# EAGLE design WBD_02 (EAGLE 9.6.2)
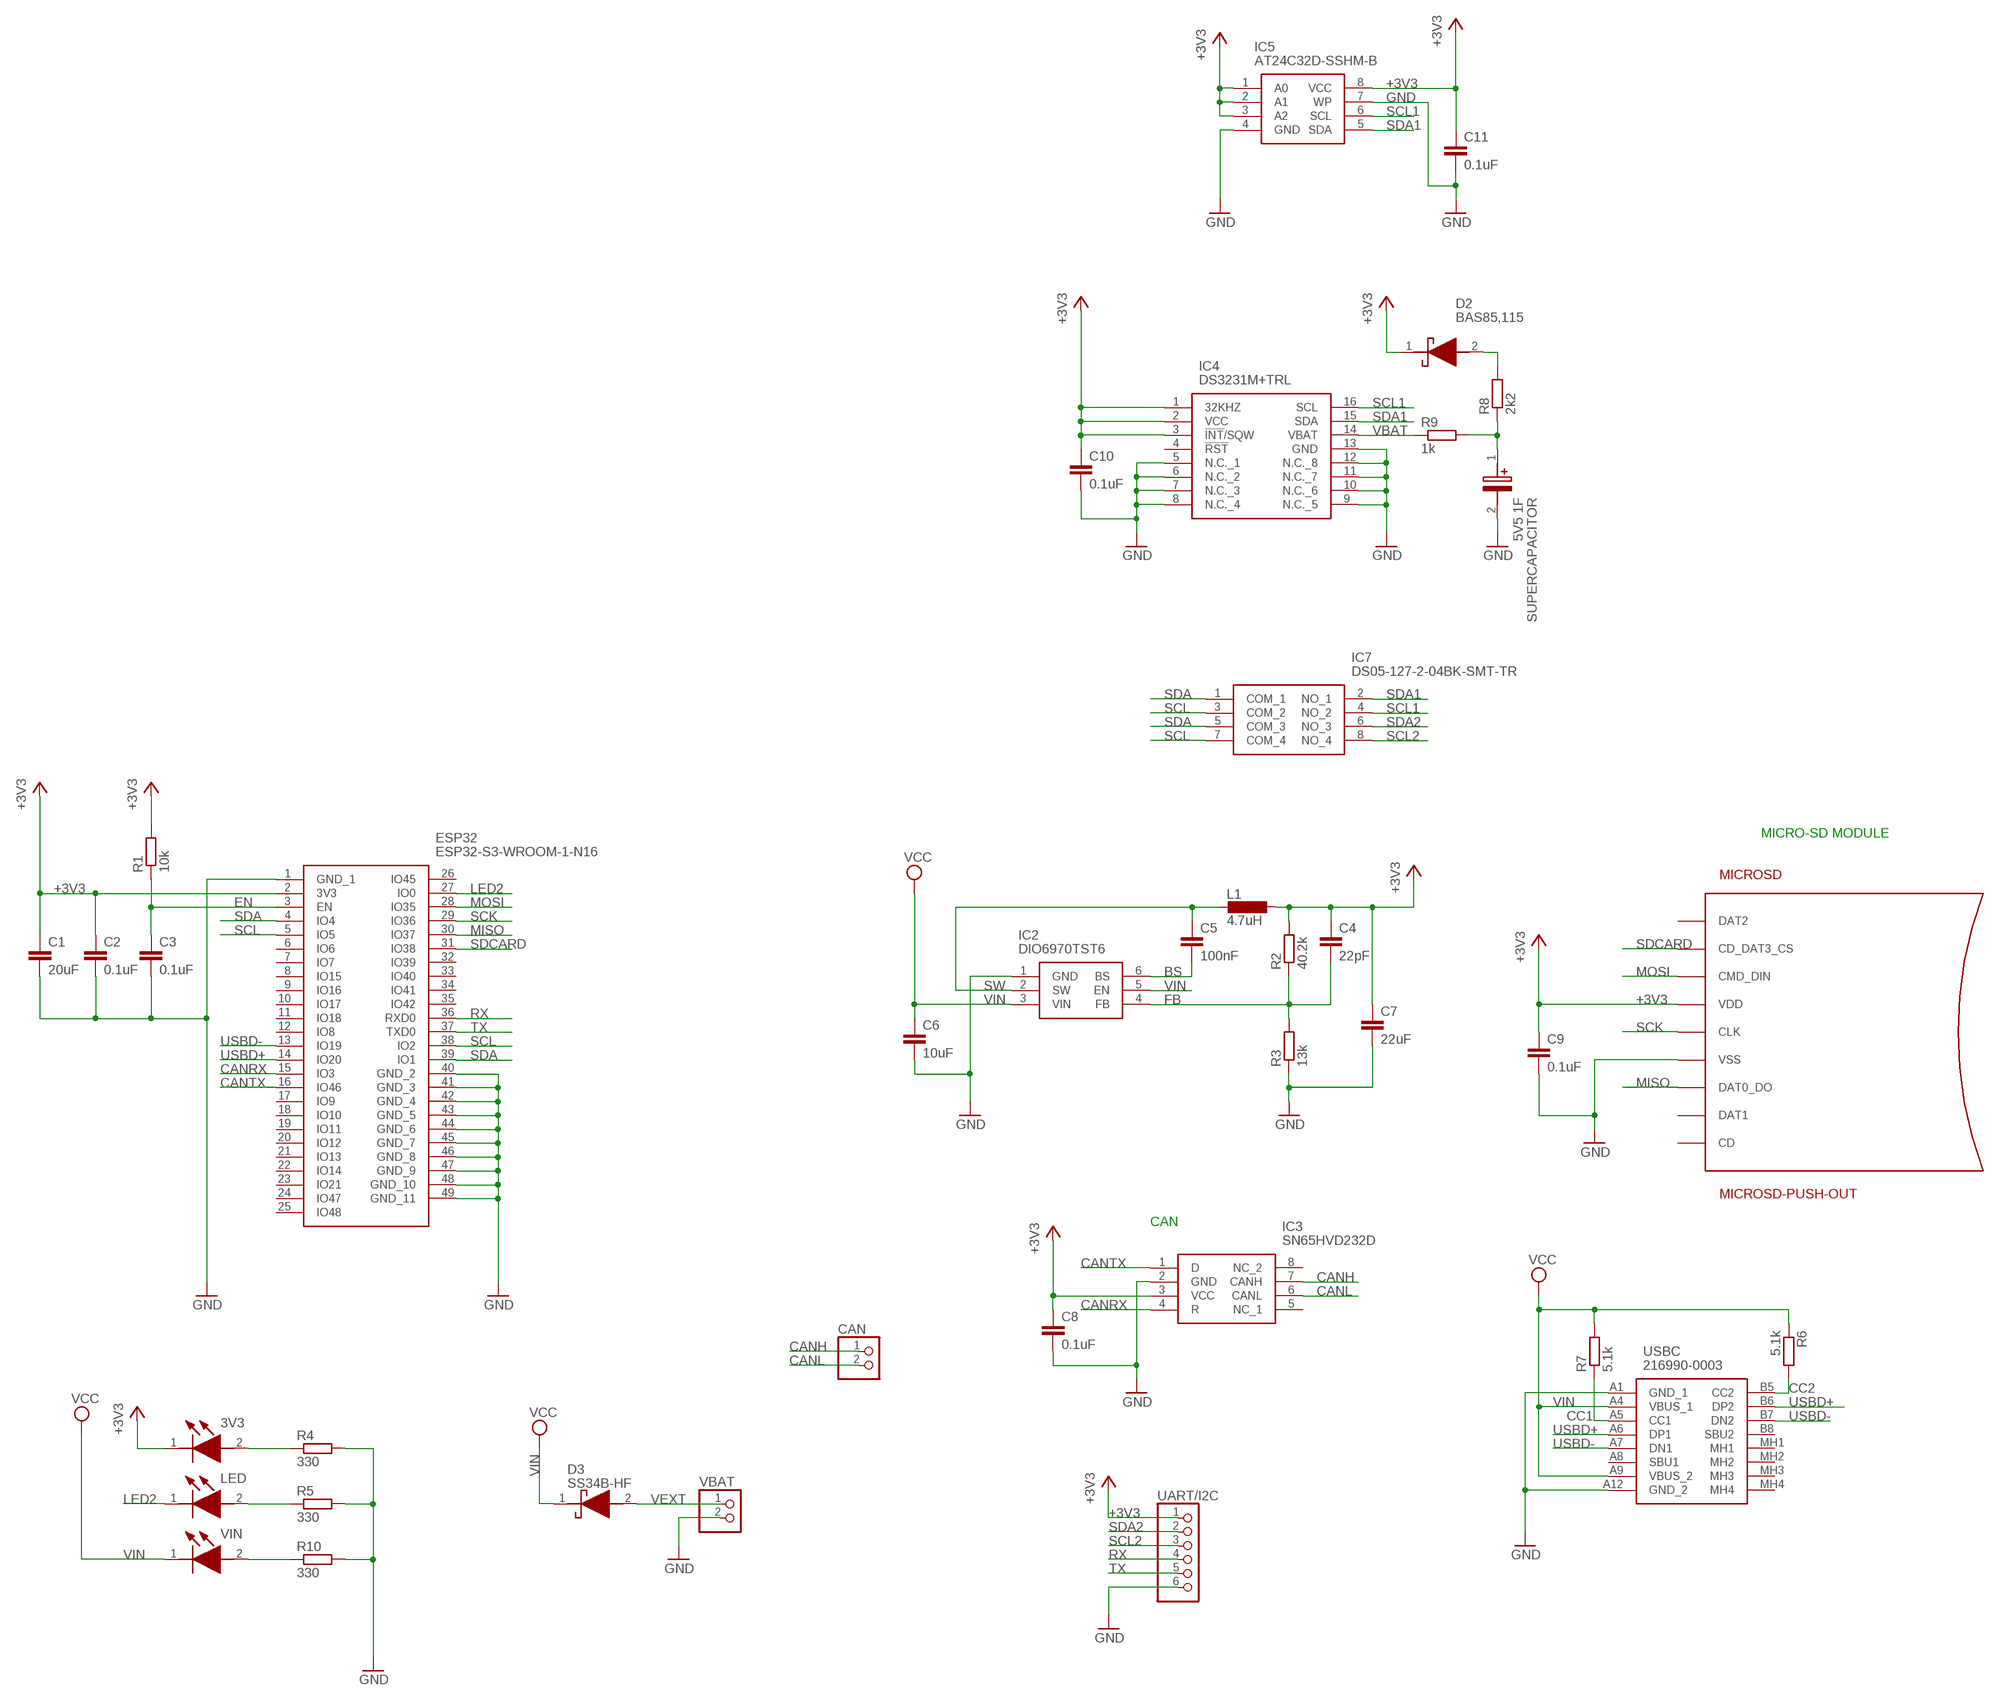
[diagram p0: schematic, sheet 1]

## Parts
3V3  150060GS75000  [LEDC1608X80N]
C1  20uF  C-EUC0603  [C0603]
C2  0.1uF  C-EUC0603  [C0603]
C3  0.1uF  C-EUC0603  [C0603]
C4  22pF  C-EUC0603  [C0603]
C5  100nF  C-EUC0603  [C0603]
C6  10uF  C-EUC0603  [C0603]
C7  22uF  C-EUC0603  [C0603]
C8  0.1uF  C-EUC0603  [C0603]
C9  0.1uF  C-EUC0603  [C0603]
C10  0.1uF  C-EUC0603  [C0603]
C11  0.1uF  C-EUC0603  [C0603]
CAN  PINHD-1X2  [1X02]
D2  BAS85,115  [BAS85115]
D3  SS34B-HF  [DIOM5336X320N]
ESP32  ESP32-S3-WROOM-1-N16  [ESP32S3WROOM1N16]
IC2  DIO6970TST6  [SOT95P280X90-6N]
IC3  SN65HVD232D  [SOIC127P600X175-8N]
IC4  DS3231M+TRL  [SOIC127P1032X265-16N]
IC5  AT24C32D-SSHM-B  [SOIC127P600X175-8N]
IC7  DS05-127-2-04BK-SMT-TR  [DS05127204BKSMTTR]
L1  4.7uH  L-EUL5650M  [L5650M]
LED  150060GS75000  [LEDC1608X80N]
MICROSD  MICROSD-PUSH-OUT  [MICROSD-PUSH-OUT]
R1  10k  R-EU_R0603  [R0603]
R2  40.2k  R-EU_R0603  [R0603]
R3  13k  R-EU_R0603  [R0603]
R4  330  R-EU_R0603  [R0603]
R5  330  R-EU_R0603  [R0603]
R6  5.1k  R-EU_R0603  [R0603]
R7  5.1k  R-EU_R0603  [R0603]
R8  2k2  R-EU_R0603  [R0603]
R9  1k  R-EU_R0603  [R0603]
R10  330  R-EU_R0603  [R0603]
SUPERCAPACITOR  5V5 1F  DB-5R5D105T  [CAPPRD500W130D2150H800]
UART/I2C  PINHD-1X6  [1X06]
USBC  216990-0003  [2169900003]
VBAT  PINHD-1X2  [1X02]
VIN  150060GS75000  [LEDC1608X80N]

## Nets
+3V3: 3V3.1(K) C1.1 C2.1 C4.1 C7.1 C8.1 C9.1 C10.1 C11.1 D2.1(K) ESP32.2(3V3) IC3.3(VCC) IC4.1(32KHZ) IC4.2(VCC) IC4.3(!INT!/SQW) IC5.1(A0) IC5.2(A1) IC5.3(A2) IC5.8(VCC) L1.1 MICROSD.4(VDD) R1.2 R2.2 UART/I2C.1
BS: C5.2 IC2.6(BS)
CANH: CAN.1 IC3.7(CANH)
CANL: CAN.2 IC3.6(CANL)
CANRX: ESP32.15(IO3) IC3.4(R)
CANTX: ESP32.16(IO46) IC3.1(D)
CC1: R7.1 USBC.A5(CC1)
CC2: R6.2 USBC.B5(CC2)
EN: C3.1 ESP32.3(EN) R1.1
FB: C4.2 IC2.4(FB) R2.1 R3.2
GND: C1.2 C2.2 C3.2 C6.2 C7.2 C8.2 C9.2 C10.2 C11.2 ESP32.1(GND_1) ESP32.40(GND_2) ESP32.41(GND_3) ESP32.42(GND_4) ESP32.43(GND_5) ESP32.44(GND_6) ESP32.45(GND_7) ESP32.46(GND_8) ESP32.47(GND_9) ESP32.48(GND_10) ESP32.49(GND_11) IC2.1(GND) IC3.2(GND) IC4.5(N.C._1) IC4.6(N.C._2) IC4.7(N.C._3) IC4.8(N.C._4) IC4.9(N.C._5) IC4.10(N.C._6) IC4.11(N.C._7) IC4.12(N.C._8) IC4.13(GND) IC5.4(GND) IC5.7(WP) MICROSD.6(VSS) MICROSD.G1(VSS) MICROSD.G2(VSS) MICROSD.G3(VSS) MICROSD.G4(VSS) R3.1 R4.2 R5.2 R10.2 SUPERCAPACITOR.2(-) UART/I2C.6 USBC.A1(GND_1) USBC.A12(GND_2) VBAT.2
LDR1: 3V3.2(A) R4.1
LDR2: LED.2(A) R5.1
LDR3: R10.1 VIN.2(A)
LED2: ESP32.27(IO0) LED.1(K)
MISO: ESP32.30(IO37) MICROSD.7(DAT0_DO)
MOSI: ESP32.28(IO35) MICROSD.3(CMD_DIN)
RTCBAT: R8.1 R9.2 SUPERCAPACITOR.1(+)
RTCD: D2.2(A) R8.2
RX: ESP32.36(RXD0) UART/I2C.4
SCK: ESP32.29(IO36) MICROSD.5(CLK)
SCL: ESP32.5(IO5) ESP32.38(IO2) IC7.3(COM_2) IC7.7(COM_4)
SCL1: IC4.16(SCL) IC5.6(SCL) IC7.4(NO_2)
SCL2: IC7.8(NO_4) UART/I2C.3
SDA: ESP32.4(IO4) ESP32.39(IO1) IC7.1(COM_1) IC7.5(COM_3)
SDA1: IC4.15(SDA) IC5.5(SDA) IC7.2(NO_1)
SDA2: IC7.6(NO_3) UART/I2C.2
SDCARD: ESP32.31(IO38) MICROSD.2(CD_DAT3_CS)
SW: C5.1 IC2.2(SW) L1.2
TX: ESP32.37(TXD0) UART/I2C.5
USBD+: ESP32.14(IO20) USBC.A6(DP1) USBC.B6(DP2)
USBD-: ESP32.13(IO19) USBC.A7(DN1) USBC.B7(DN2)
VBAT: IC4.14(VBAT) R9.1
VEXT: D3.2(A) VBAT.1
VIN: C6.1 D3.1(K) IC2.3(VIN) IC2.5(EN) R6.1 R7.2 USBC.A4(VBUS_1) USBC.A9(VBUS_2) VIN.1(K) ; supply symbol labelled VCC
Unconnected: ESP32.6(IO6) ESP32.7(IO7) ESP32.8(IO15) ESP32.9(IO16) ESP32.10(IO17) ESP32.11(IO18) ESP32.12(IO8) ESP32.17(IO9) ESP32.18(IO10) ESP32.19(IO11) ESP32.20(IO12) ESP32.21(IO13) ESP32.22(IO14) ESP32.23(IO21) ESP32.24(IO47) ESP32.25(IO48) ESP32.26(IO45) ESP32.32(IO39) ESP32.33(IO40) ESP32.34(IO41) ESP32.35(IO42) IC3.5(NC_1) IC3.8(NC_2) IC4.4(!RST) MICROSD.1(DAT2) MICROSD.8(DAT1) MICROSD.CD USBC.A8(SBU1) USBC.B8(SBU2) USBC.MH1 USBC.MH2 USBC.MH3 USBC.MH4

## Notes on the sheet
- MICRO-SD MODULE
- CAN

## Library data of the parts
3V3 LED VIN = SamacSys_Parts:150060GS75000: Wurth Elektronik WL-SMCW 520 nm Green LED, 1608 (0603) Clear SMD package Source: Datasheet <https://componentsearchengine.com/Datasheets/2/150060GS75000.pdf>; DESCRIPTION: Wurth Elektronik WL-SMCW 520 nm Green LED, 1608 (0603) Clear SMD package; HEIGHT: 0.8mm; MANUFACTURER_NAME: Wurth Elektronik; MANUFACTURER_PART_NUMBER: 150060GS75000; MOUSER_PART_NUMBER: 710-150060GS75000; MOUSER_PRICE-STOCK: https://www.mouser.co.uk/ProductDetail/Wurth-Elektronik/150060GS75000?qs=LlUlMxKIyB0UYkq5lDO8nA%3D%3D
C1-C11 = rcl:C-EU: CAPACITOR, European symbol
CAN VBAT = pinhead:PINHD-1X2: PIN HEADER
D2 = SamacSys_Parts:BAS85,115: Schottky Diodes & Rectifiers SCHOTTKY 30V 200MA Source: Datasheet <https://assets.nexperia.com/documents/data-sheet/BAS85.pdf>; DESCRIPTION: Schottky Diodes & Rectifiers SCHOTTKY 30V 200MA; HEIGHT: 1.6mm; MANUFACTURER_NAME: Nexperia; MANUFACTURER_PART_NUMBER: BAS85,115; MOUSER_PART_NUMBER: 771-BAS85-T/R; MOUSER_PRICE-STOCK: https://www.mouser.co.uk/ProductDetail/Nexperia/BAS85115?qs=me8TqzrmIYWCmVXtgUH2Gg%3D%3D
D3 = SamacSys_Parts:SS34B-HF: Schottky Diodes & Rectifiers DIODE SCHOTTKY 3A 40V SMB Source: Datasheet <https://www.mouser.jp/datasheet/2/80/SP-JB017_SS34B-HF_Thru._SS320B-HF_RevB-1847021.pdf>; DESCRIPTION: Schottky Diodes & Rectifiers DIODE SCHOTTKY 3A 40V SMB; HEIGHT: 3.2mm; MANUFACTURER_NAME: Comchip Technology; MANUFACTURER_PART_NUMBER: SS34B-HF; MOUSER_PART_NUMBER: 750-SS34B-HF; MOUSER_PRICE-STOCK: https://www.mouser.co.uk/ProductDetail/Comchip-Technology/SS34B-HF?qs=vmHwEFxEFR9G1M%252BcUPG%2FxQ%3D%3D
ESP32 = ESP32-S3-WROOM-1-N16:ESP32-S3-WROOM-1-N16: WiFi Modules - 802.11 [Engineering Samples] SMD Module, ESP32-S3, 16 MB SPI Flash, PCB Antenna Source: Datasheet <https://www.espressif.com/sites/default/files/documentation/esp32-s3-wroom-1_wroom-1u_datasheet_en.pdf>; DESCRIPTION: WiFi Modules - 802.11 [Engineering Samples] SMD Module, ESP32-S3, 16 MB SPI Flash, PCB Antenna; HEIGHT: 3.25mm; MANUFACTURER_NAME: Espressif Systems; MANUFACTURER_PART_NUMBER: ESP32-S3-WROOM-1-N16; MOUSER_PART_NUMBER: 356-ESP32S3WROOM1N16; MOUSER_PRICE-STOCK: https://www.mouser.co.uk/ProductDetail/Espressif-Systems/ESP32-S3-WROOM-1-N16?qs=Li%252BoUPsLEntjPrtJwwS5Pw%3D%3D
IC2 = SamacSys_Parts:DIO6970TST6: Switching Voltage Regulators 2A Step Converter 24V Input Sync Source: Datasheet; DESCRIPTION: Switching Voltage Regulators 2A Step Converter 24V Input Sync; HEIGHT: 0.9mm; MANUFACTURER_NAME: DIOO Microcircuits; MANUFACTURER_PART_NUMBER: DIO6970TST6; MOUSER_PART_NUMBER: 453-DIO6970ST6; MOUSER_PRICE-STOCK: https://www.mouser.co.uk/ProductDetail/DIOO-Microcircuits/DIO6970TST6?qs=%252BEew9%252B0nqrCWpKu8WqElxA%3D%3D
IC3 = SamacSys_Parts:SN65HVD232D: CAN Transceiver 1Mbit/s ISO 11898, 8-Pin SOIC Source: Datasheet <http://www.ti.com/lit/ds/symlink/sn65hvd232.pdf>; DESCRIPTION: CAN Transceiver 1Mbit/s ISO 11898, 8-Pin SOIC; HEIGHT: 1.75mm; MANUFACTURER_NAME: Texas Instruments; MANUFACTURER_PART_NUMBER: SN65HVD232D; MOUSER_PART_NUMBER: 595-SN65HVD232D; MOUSER_PRICE-STOCK: https://www.mouser.co.uk/ProductDetail/Texas-Instruments/SN65HVD232D?qs=QViXGNcIEAueLIS9b8IyYg%3D%3D
IC4 = SamacSys_Parts:DS3231M+TRL: +/-5ppm, I2C Real-Time Clock Source: Datasheet <http://componentsearchengine.com/Datasheets/1/DS3231M TRL.pdf>; DESCRIPTION: +/-5ppm, I2C Real-Time Clock; HEIGHT: 2.65mm; MANUFACTURER_NAME: Maxim Integrated; MANUFACTURER_PART_NUMBER: DS3231M+TRL; MOUSER_PART_NUMBER: 700-DS3231M+TRL; MOUSER_PRICE-STOCK: https://www.mouser.co.uk/ProductDetail/Maxim-Integrated/DS3231M%2bTRL?qs=Bakm8ERcljq5PBzSwLfmgg%3D%3D
IC5 = SamacSys_Parts:AT24C32D-SSHM-B: AT24C32D-SSHM-B, EEPROM Memory 32kbit,, 4096 x, 8bit, Serial-2 Wire, 550ns 1.7 5.5 V, 8-Pin SOIC Source: Datasheet <http://www.atmel.com/images/atmel-8866-seeprom-at24c32d-datasheet.pdf>; DESCRIPTION: AT24C32D-SSHM-B, EEPROM Memory 32kbit,, 4096 x, 8bit, Serial-2 Wire, 550ns 1.7 5.5 V, 8-Pin SOIC; HEIGHT: 1.75mm; MANUFACTURER_NAME: Microchip; MANUFACTURER_PART_NUMBER: AT24C32D-SSHM-B; MOUSER_PART_NUMBER: 556-AT24C32D-SSHM-B; MOUSER_PRICE-STOCK: https://www.mouser.co.uk/ProductDetail/Microchip-Technology-Atmel/AT24C32D-SSHM-B?qs=ZZMt4ii29sN2mTRLl%2FnVJA%3D%3D
IC7 = SamacSys_Parts:DS05-127-2-04BK-SMT-TR: DIP Switches / SIP Switches DIP Switch, SPST, 1.27 pitch, flat actuator, SMT, Tape and reel, 4 position, Black Source: Datasheet <https://www.cuidevices.com/product/resource/digikeypdf/ds05-127-smt.pdf>; DESCRIPTION: DIP Switches / SIP Switches DIP Switch, SPST, 1.27 pitch, flat actuator, SMT, Tape and reel, 4 position, Black; HEIGHT: 2.6mm; MANUFACTURER_NAME: CUI Devices; MANUFACTURER_PART_NUMBER: DS05-127-2-04BK-SMT-TR; MOUSER_PART_NUMBER: 490-DS05127204BK-STR; MOUSER_PRICE-STOCK: https://www.mouser.co.uk/ProductDetail/CUI-Devices/DS05-127-2-04BK-SMT-TR?qs=wnTfsH77Xs6LBykqEPH3sg%3D%3D
L1 = rcl:L-EU: INDUCTOR, European symbol; SPICEPREFIX: L
MICROSD = microsd:MICROSD-PUSH-OUT: T-Flash Push-Out Micro SD Card Reader 14.75mm x 14.5mm SMD with external pins
R1-R10 = rcl:R-EU_: RESISTOR, European symbol; SPICEPREFIX: R
SUPERCAPACITOR = SamacSys_Parts:DB-5R5D105T: Supercapacitors / Ultracapacitors MEM CAP 5.5V 1.0F Source: Datasheet; DESCRIPTION: Supercapacitors / Ultracapacitors MEM CAP 5.5V 1.0F; HEIGHT: 8mm; MANUFACTURER_NAME: Elna; MANUFACTURER_PART_NUMBER: DB-5R5D105T; MOUSER_PART_NUMBER: 555-DB-5R5D105T; MOUSER_PRICE-STOCK: https://www.mouser.co.uk/ProductDetail/Elna/DB-5R5D105T?qs=r8OyiFxb6Rcu1BWmqcONIQ%3D%3D
UART/I2C = pinhead:PINHD-1X6: PIN HEADER
USBC = SamacSys_Parts:216990-0003: USB Connectors Mid-Mnt SMT CH0.58 16Ckt Type C Rec. Source: Datasheet <https://www.molex.com/pdm_docs/sd/2169900003_sd.pdf>; DESCRIPTION: USB Connectors Mid-Mnt SMT CH0.58 16Ckt Type C Rec.; HEIGHT: 3.36mm; MANUFACTURER_NAME: Molex; MANUFACTURER_PART_NUMBER: 216990-0003; MOUSER_PART_NUMBER: 538-216990-0003; MOUSER_PRICE-STOCK: https://www.mouser.co.uk/ProductDetail/Molex/216990-0003?qs=DRkmTr78QASn0GILUGAYCA%3D%3D

## Board
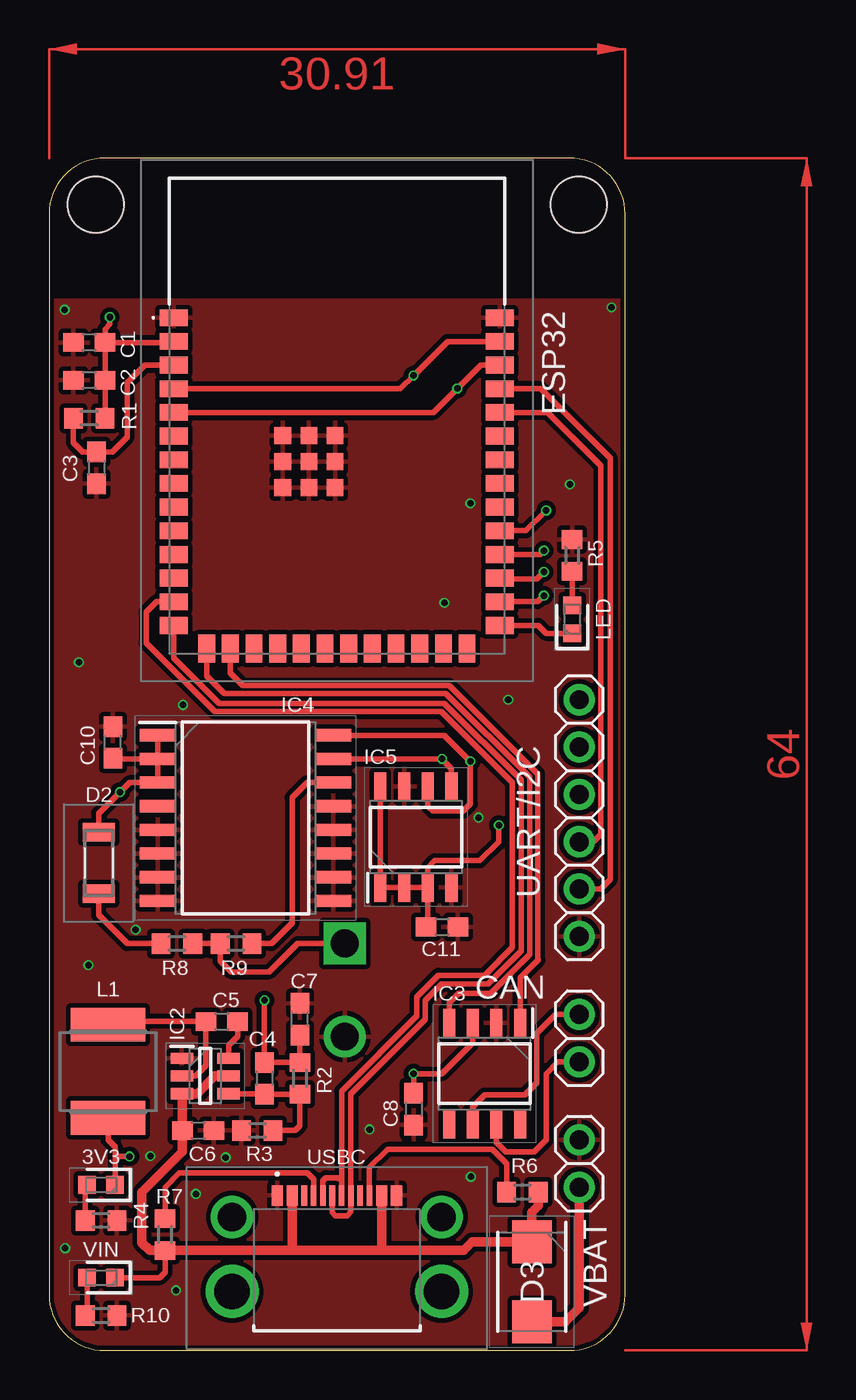
[diagram p1: board, top side]
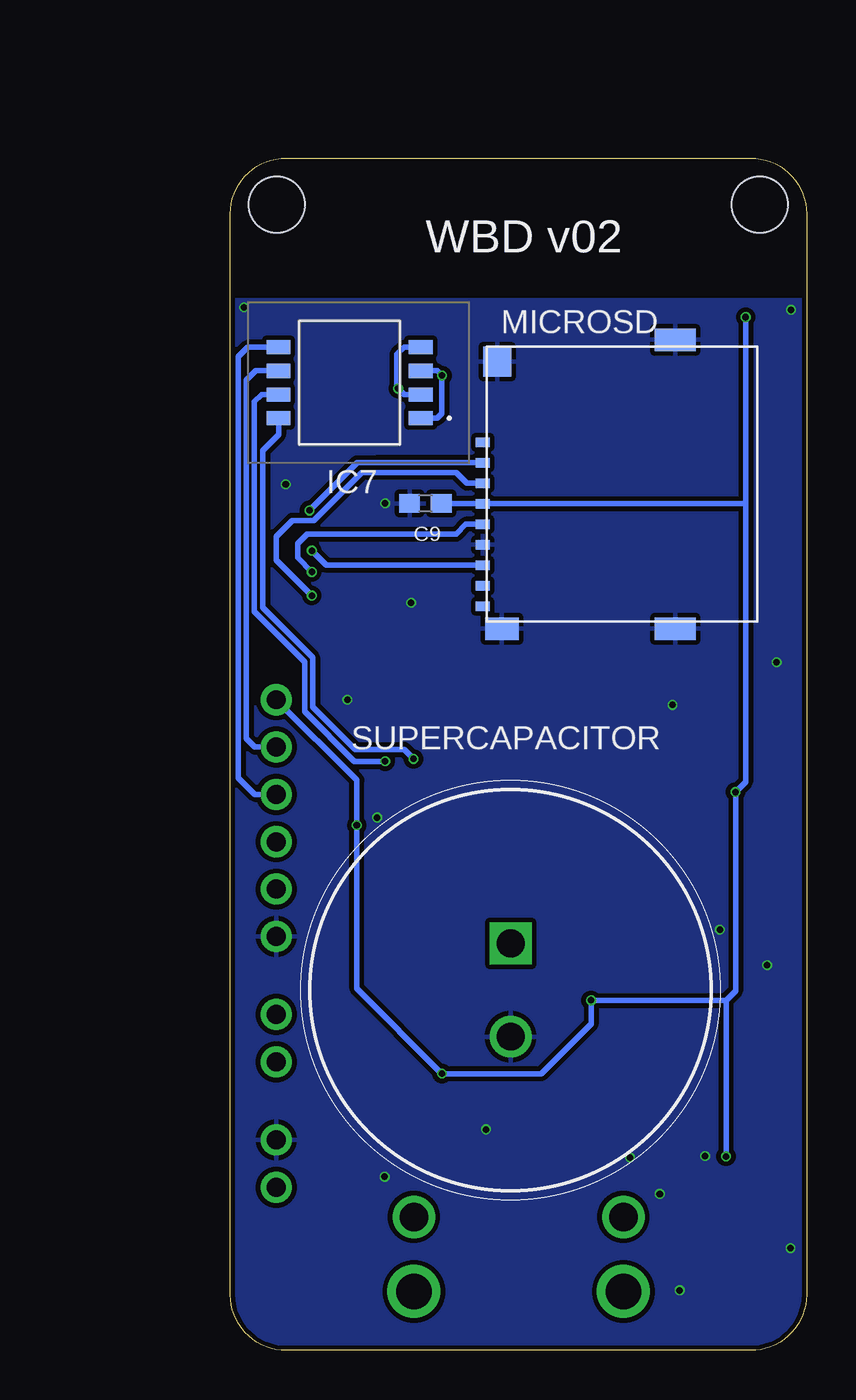
[diagram p2: board, bottom side, seen from below]

Size 30.91 x 64 mm. Coordinates in mm from the lower left corner, seen from the top.
Outline: 30.91,3 30.91,61 arc90 27.91,64 3,64 arc90 0,61 0,3 arc90 3,0 27.91,0 arc90 30.91,3
Copper layers (1*16): Top 0.035559375mm / dielectric 1.6mm / Bottom 0.035559375mm
Design rules "jlcpcb2layer": minimum track width 5mil, minimum drill 12mil, track to track 5mil, track to pad 5mil, pad to pad 5mil, via to via 5mil, smd to smd 5mil, copper to edge 8mil, drill to drill 6mil, minimum pad ring 5mil, minimum via ring 3mil, stop-mask expansion 2.5mil, vias tented up to drill 0mil, thermal gap 10mil
Holes 3 mm at 2.51,61.5 28.42,61.5

### Footprints (pad centres in the part's own frame; a part is rotated, then mirrored left to right if it is on the bottom)
LEDC1608X80N = smd 0.95 x 0.95: 1 -0.75,0; 2 0.75,0
C0603 = smd 1.1 x 1: 1 -0.85,0; 2 0.85,0
1X02 = drill 1.016 pad 1.676: 1 -1.27,0; 2 1.27,0
BAS85115 = smd 1 x 1.7: 1 -1.65,0; 2 1.65,0
DIOM5336X320N = smd 2.3 x 2.1: 1 -2.15,0; 2 2.15,0
ESP32S3WROOM1N16 = smd 1.5 x 0.9: 1 -8.75,5.26; 2 -8.75,3.99; 3 -8.75,2.72; 4 -8.75,1.45; 5 -8.75,0.18; 6 -8.75,-1.09; 7 -8.75,-2.36; 8 -8.75,-3.63; 9 -8.75,-4.9; 10 -8.75,-6.17; 11 -8.75,-7.44; 12 -8.75,-8.71; 13 -8.75,-9.98; 14 -8.75,-11.25; 27 8.75,-11.25; 28 8.75,-9.98; 29 8.75,-8.71; 30 8.75,-7.44; 31 8.75,-6.17; 32 8.75,-4.9; 33 8.75,-3.63; 34 8.75,-2.36; 35 8.75,-1.09; 36 8.75,0.18; 37 8.75,1.45; 38 8.75,2.72; 39 8.75,3.99; 40 8.75,5.26 | smd 0.9 x 1.5: 15 -6.985,-12.5; 16 -5.715,-12.5; 17 -4.445,-12.5; 18 -3.175,-12.5; 19 -1.905,-12.5; 20 -0.635,-12.5; 21 0.635,-12.5; 22 1.905,-12.5; 23 3.175,-12.5; 24 4.445,-12.5; 25 5.715,-12.5; 26 6.985,-12.5 | smd 0.9 x 0.9: 41 -1.5,-2.46; 42 -1.5,-1.06; 43 -2.9,-1.06; 44 -2.9,-2.46; 45 -2.9,-3.86; 46 -1.5,-3.86; 47 -0.1,-3.86; 48 -0.1,-2.46; 49 -0.1,-1.06
SOT95P280X90-6N = smd 1.2 x 0.6: 1 -1.25,0.95; 2 -1.25,0; 3 -1.25,-0.95; 4 1.25,-0.95; 5 1.25,0; 6 1.25,0.95
SOIC127P600X175-8N = smd 1.528 x 0.65: 1 -2.711,1.905; 2 -2.711,0.635; 3 -2.711,-0.635; 4 -2.711,-1.905; 5 2.711,-1.905; 6 2.711,-0.635; 7 2.711,0.635; 8 2.711,1.905
SOIC127P1032X265-16N = smd 1.925 x 0.65: 1 -4.712,4.445; 2 -4.712,3.175; 3 -4.712,1.905; 4 -4.712,0.635; 5 -4.712,-0.635; 6 -4.712,-1.905; 7 -4.712,-3.175; 8 -4.712,-4.445; 9 4.712,-4.445; 10 4.712,-3.175; 11 4.712,-1.905; 12 4.712,-0.635; 13 4.712,0.635; 14 4.712,1.905; 15 4.712,3.175; 16 4.712,4.445
DS05127204BKSMTTR = smd 0.76 x 1.27: 1 -1.905,-3.81; 2 -1.905,3.81; 3 -0.635,-3.81; 4 -0.635,3.81; 5 0.635,-3.81; 6 0.635,3.81; 7 1.905,-3.81; 8 1.905,3.81
L5650M = smd 1.8 x 4: 1 -2.5,0; 2 2.5,0
MICROSD-PUSH-OUT = smd 0.5 x 0.75: 1 9.625,0.225; 2 8.525,0.225; 3 7.425,0.225; 4 6.325,0.225; 5 5.225,0.225; 6 4.125,0.225; 7 3.025,0.225; 8 1.925,0.225; CD 0.825,0.225 | smd 1.2 x 1.8: G1 -0.375,-0.8 | smd 1.2 x 2.2: G2 -0.375,-10.1; G4 15.125,-10.1 | smd 1.6 x 1.5: G3 13.95,-0.55
R0603 = smd 1 x 1.1: 1 -0.85,0; 2 0.85,0
CAPPRD500W130D2150H800 = drill 1.5 pad 2.25 square: 1 0,0 | drill 1.5 pad 2.25: 2 5,0
1X06 = drill 1.016 pad 1.676: 1 -6.35,0; 2 -3.81,0; 3 -1.27,0; 4 1.27,0; 5 3.81,0; 6 6.35,0
2169900003 = smd 0.6 x 1.1: A1 -3.2,4; A4 -2.4,4; A9 2.4,4; A12 3.2,4 | smd 0.3 x 1.1: A5 -1.25,4; A6 -0.25,4; A7 0.25,4; A8 1.25,4; B5 1.75,4; B6 0.75,4; B7 -0.75,4; B8 -1.75,4 | drill 1.52 pad 2.28: MH1 -5.62,2.85; MH4 5.62,2.85 | drill 1.9 pad 2.85: MH2 -5.62,-1.15; MH3 5.62,-1.15

### Placement (x,y rotation side)
3V3  2.79,8.89 180 top
C1  2.16,54.1 180 top
C2  2.16,52.07 180 top
C3  2.54,47.37 270 top
C4  11.56,14.61 270 top
C5  9.27,17.65 0 top
C6  8,11.81 0 top
C7  13.46,17.78 90 top
C8  19.56,12.95 270 top
C9  20.45,45.47 180 bottom
C10  3.43,32.64 90 top
C11  21.08,22.73 0 top
CAN  28.45,16.76 90 top
D2  2.67,26.16 270 top
D3  25.91,3.68 270 top
ESP32  15.44,50.16 0 top
IC2  8.38,14.73 0 top
IC3  23.37,14.86 270 top
IC4  10.54,28.57 0 top
IC5  19.68,27.56 90 top
IC7  24.51,51.94 90 bottom
L1  3.17,14.99 90 top
LED  28.07,39.24 90 top
MICROSD  17.14,39.12 90 bottom
R1  2.16,50.04 0 top
R2  13.46,14.61 90 top
R3  11.18,11.81 0 top
R4  2.79,6.99 0 top
R5  28.07,42.67 90 top
R6  25.4,8.51 180 top
R7  6.22,6.22 270 top
R8  6.86,21.84 180 top
R9  10.03,21.84 180 top
R10  2.79,1.88 0 top
SUPERCAPACITOR  15.88,21.84 270 bottom
UART/I2C  28.45,28.57 270 top
USBC  15.44,4.32 0 top
VBAT  28.45,10.03 90 top
VIN  2.79,3.91 180 top

### Tracks (layer width: path | path; a pad name or v marks a point on that pad's centre or on a via)
+3V3  (via drill 0.35)
  Top 0.305: IC5.8 IC5.1 IC5.2 IC5.3 | IC4.2 IC4.3 4.32,30.48 v3.81,29.97 2.67,28.83 D2.1 | IC4.2 IC4.1 | C8.1 v19.56,14.86 21.08,14.86 22.73,16.51 IC3.3 | C1.1 C2.1 R1.2 | ESP32.2 6.44,54.1 C1.1 | IC5.3 20.32,22.82 C11.1 | IC4.2 3.47,31.75 C10.1 | IC5.3 20.32,25.91 20.7,26.29 23.11,26.29 24.13,27.3 v24.13,28.19 | L1.1 3.17,11.3 3.54,10.93 3.54,10.41 | v4.32,10.41 3.54,10.41 | C7.1 R2.2 C4.1 v11.56,18.8 | 3.54,10.41 3V3.1 | v3.26,55.46 3.26,55.08 3.01,54.83 C1.1
  Bottom 0.305: v4.32,10.41 4.32,18.8 | 4.32,18.8 v11.56,18.8 11.56,17.53 14.22,14.86 v19.56,14.86 24.13,19.43 v24.13,28.19 24.13,30.61 UART/I2C.1 | C9.1 19.57,45.44 MICROSD.4 3.29,45.44 3.26,45.47 | 4.32,18.8 3.81,19.3 v3.81,29.97 3.26,30.52 3.26,45.47 | v3.26,55.46 3.26,45.47
BS
  Top 0.305: IC2.6 9.63,16.36 10.12,16.85 C5.2
CANH
  Top 0.305: IC3.7 24,11.18 24.51,10.67 26.04,10.67 26.67,11.3 26.67,14.86 27.3,15.49 CAN.1
CANL
  Top 0.305: IC3.6 22.73,13.08 23.37,13.72 25.53,13.72 26.16,14.35 26.16,17.02 27.18,18.03 CAN.2
CANRX
  Top 0.305: IC3.4 21.46,18.67 21.97,19.18 23.7,19.18 25.78,21.26 25.78,30.77 21.29,35.26 9.4,35.26 8.46,36.2 ESP32.15
CANTX
  Top 0.305: IC3.1 25.27,19.99 26.24,20.95 26.21,20.98 26.21,30.95 21.46,35.7 10.4,35.7 9.73,36.37 ESP32.16
CC1
  Top 0.305: R7.1 6.22,8.76 6.99,9.53 13.84,9.53 14.19,9.18 USBC.A5
CC2
  Top 0.305: USBC.B5 17.19,9.83 18.16,10.79 23.77,10.79 24.55,10.02 R6.2
EN
  Top 0.305: R1.1 1.31,48.73 1.82,48.22 C3.1 3.39,48.22 4.19,49.02 4.19,51.94 5.13,52.88 ESP32.3
FB
  Top 0.305: IC2.4 11.53,13.78 C4.2 R2.1 13.46,12.06 13.21,11.81 R3.2
GND  (via drill 0.35)
  other vias: 27.94,46.48 23.04,28.6 9.47,10.36 2.11,20.68 6.81,3.23 0.86,5.49 17.2,11.86 7.87,8.41 4.65,22.58 30.18,55.98 0.84,55.85 1.6,36.93 7.19,34.65 22.63,9.32 5.44,10.44 24.64,34.92 22.61,45.47 21.21,40.13
  pour Top (isolate 0.254): 0,56.39 30.99,56.39 30.99,0 0,0
  pour Bottom (isolate 0.254): 0,56.39 30.99,56.39 30.99,0 0,0
LDR1
  Top 0.305: R4.1 1.94,8.79 3V3.2
LDR2
  Top 0.305: LED.2 R5.1
LDR3
  Top 0.305: VIN.2 2.04,1.98 R10.1
LED2
  Top 0.305: ESP32.27 26.24,38.91 26.67,38.48 28.05,38.48 LED.1
MISO  (via drill 0.35)
  Top 0.305: ESP32.30 26.34,42.73 v26.54,42.93
  Bottom 0.305: v26.54,42.93 25.76,42.14 MICROSD.7
MOSI  (via drill 0.35)
  Top 0.305: v26.54,40.51 26.21,40.19 ESP32.28
  Bottom 0.305: MICROSD.3 18.22,46.54 18.8,47.12 23.87,47.12 26.45,44.54 27.59,44.54 28.45,43.69 28.45,42.42 v26.54,40.51
RTCBAT
  Top 0.305: R8.1 R9.2 9.18,20.92 9.78,20.32 11.81,20.32 13.34,21.84 SUPERCAPACITOR.1
RTCD
  Top 0.305: R8.2 4.19,21.84 2.67,23.37 D2.2
RX
  Top 0.305: ESP32.36 26.74,50.34 29.59,47.5 29.59,27.69 29.21,27.3 UART/I2C.4
SCK  (via drill 0.35)
  Top 0.305: ESP32.29 24.25,41.4 26.16,41.4 v26.54,41.78
  Bottom 0.305: MICROSD.5 18.27,44.34 18.8,43.81 26.8,43.81 27.3,43.31 27.3,42.55 v26.54,41.78
SCL  (via drill 0.35)
  Top 0.305: ESP32.5 20.63,50.34 v21.91,51.63 23.17,52.88 ESP32.38
  Bottom 0.305: IC7.7 21.59,53.85 21.97,53.47 21.97,51.69 v21.91,51.63 21.59,51.31 IC7.3
SCL1  (via drill 0.35)
  Top 0.305: IC4.16 21.21,33.02 v22.61,31.62 22.61,29.34 22.23,28.96 20.57,28.96 20.32,29.21 IC5.6
  Bottom 0.305: IC7.4 29.23,51.31 29.62,50.93 29.62,39.65 26.92,36.96 26.92,34.29 24.26,31.62 v22.61,31.62
SCL2
  Bottom 0.305: IC7.8 29.97,53.85 30.48,53.34 30.48,30.73 29.59,29.84 UART/I2C.3
SDA  (via drill 0.35)
  Top 0.305: ESP32.4 18.85,51.62 v19.56,52.32 21.39,54.16 ESP32.39
  Bottom 0.305: IC7.5 19.81,52.58 v19.56,52.32 19.56,50.29 19.81,50.04 IC7.1
SDA1  (via drill 0.35)
  Top 0.305: IC4.15 v21.08,31.75 21.59,31.24 IC5.5
  Bottom 0.305: IC7.2 28.32,49.15 29.18,48.28 29.18,39.88 26.49,37.19 26.49,34.54 24.21,32.26 21.59,32.26 v21.08,31.75
SDA2
  Bottom 0.305: IC7.6 29.54,52.58 30.05,52.07 30.05,32.84 29.59,32.38 UART/I2C.2
SDCARD  (via drill 0.35)
  Top 0.305: ESP32.31 25.58,43.99 v26.67,45.09
  Bottom 0.305: MICROSD.2 22.73,47.64 23.1,47.64 24.11,47.64 v26.67,45.09
SW
  Top 0.305: IC2.2 7.87,14.73 8.42,15.28 C5.1 3.34,17.65 L1.2
TX
  Top 0.305: ESP32.37 26.39,51.62 30.1,47.91 30.1,25.27 29.59,24.77 UART/I2C.5
USBD+
  Top 0.305: USBC.A6 15.19,7.41 15.37,7.24 16,7.24 16.19,7.43 USBC.B6 16.19,13.78 20.19,17.78 20.19,18.8 21.08,19.68 23.56,19.68 25.32,21.45 25.32,30.61 21.22,34.72 9.14,34.72 6.69,37.17 ESP32.14
USBD-
  Top 0.305: USBC.B7 14.69,9.11 14.86,9.27 15.49,9.27 15.69,9.07 | 15.69,9.07 USBC.A7 | ESP32.13 5.77,40.19 5.21,39.62 5.21,37.97 8.89,34.29 21.04,34.29 24.85,30.48 24.85,21.62 23.37,20.14 20.89,20.14 19.74,18.98 19.74,17.96 15.69,13.91 15.69,9.07
VBAT
  Top 0.305: IC4.14 13.84,30.48 13.04,29.68 13.04,22.95 11.94,21.84 R9.1
VEXT
  Top 0.508: VBAT.1 28.45,2.29 27.7,1.53 D3.2
VIN
  Top 0.305: VIN.1 5.94,3.91 6.22,4.19 R7.2
  Top 0.508: 17.83,5.37 13.11,5.37 13.04,5.44 | USBC.A4 13.04,5.44 | USBC.A9 17.84,5.38 17.83,5.37 | IC2.5 8.89,14.73 7.94,13.78 IC2.3 7.15,13.76 C6.1 7.15,10.65 4.98,8.48 4.98,5.79 5.4,5.37 R7.2 13.04,5.37 13.04,5.44 | R6.1 26.25,7.76 25.91,7.42 D3.1 22.7,5.83 22.24,5.37 17.83,5.37
(copper drawn outside any net)
  shapes: Top area x2

### Text on the board
bNames: WBD v02